# EasyEDA Pro project magic_board.epro, board main
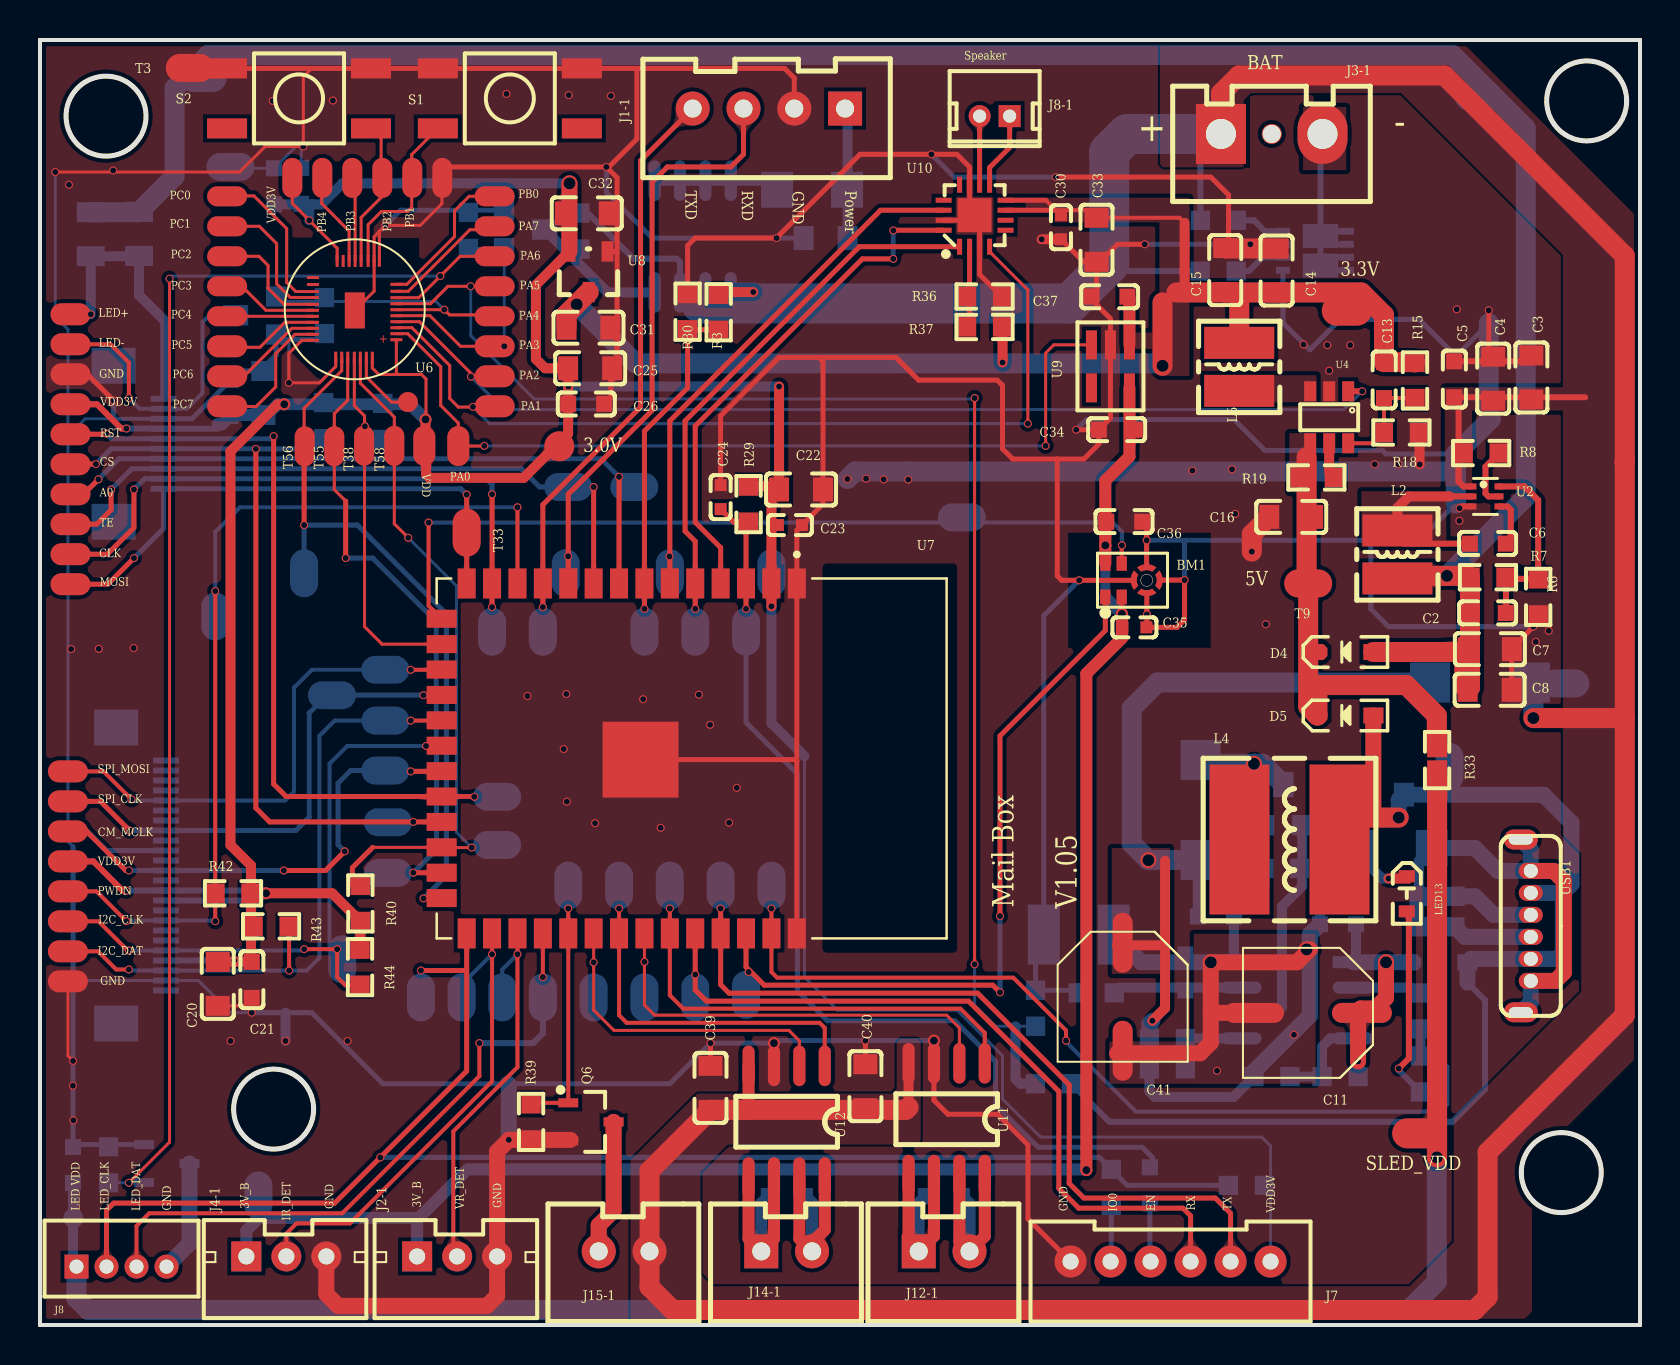
[diagram p0: board, top side]
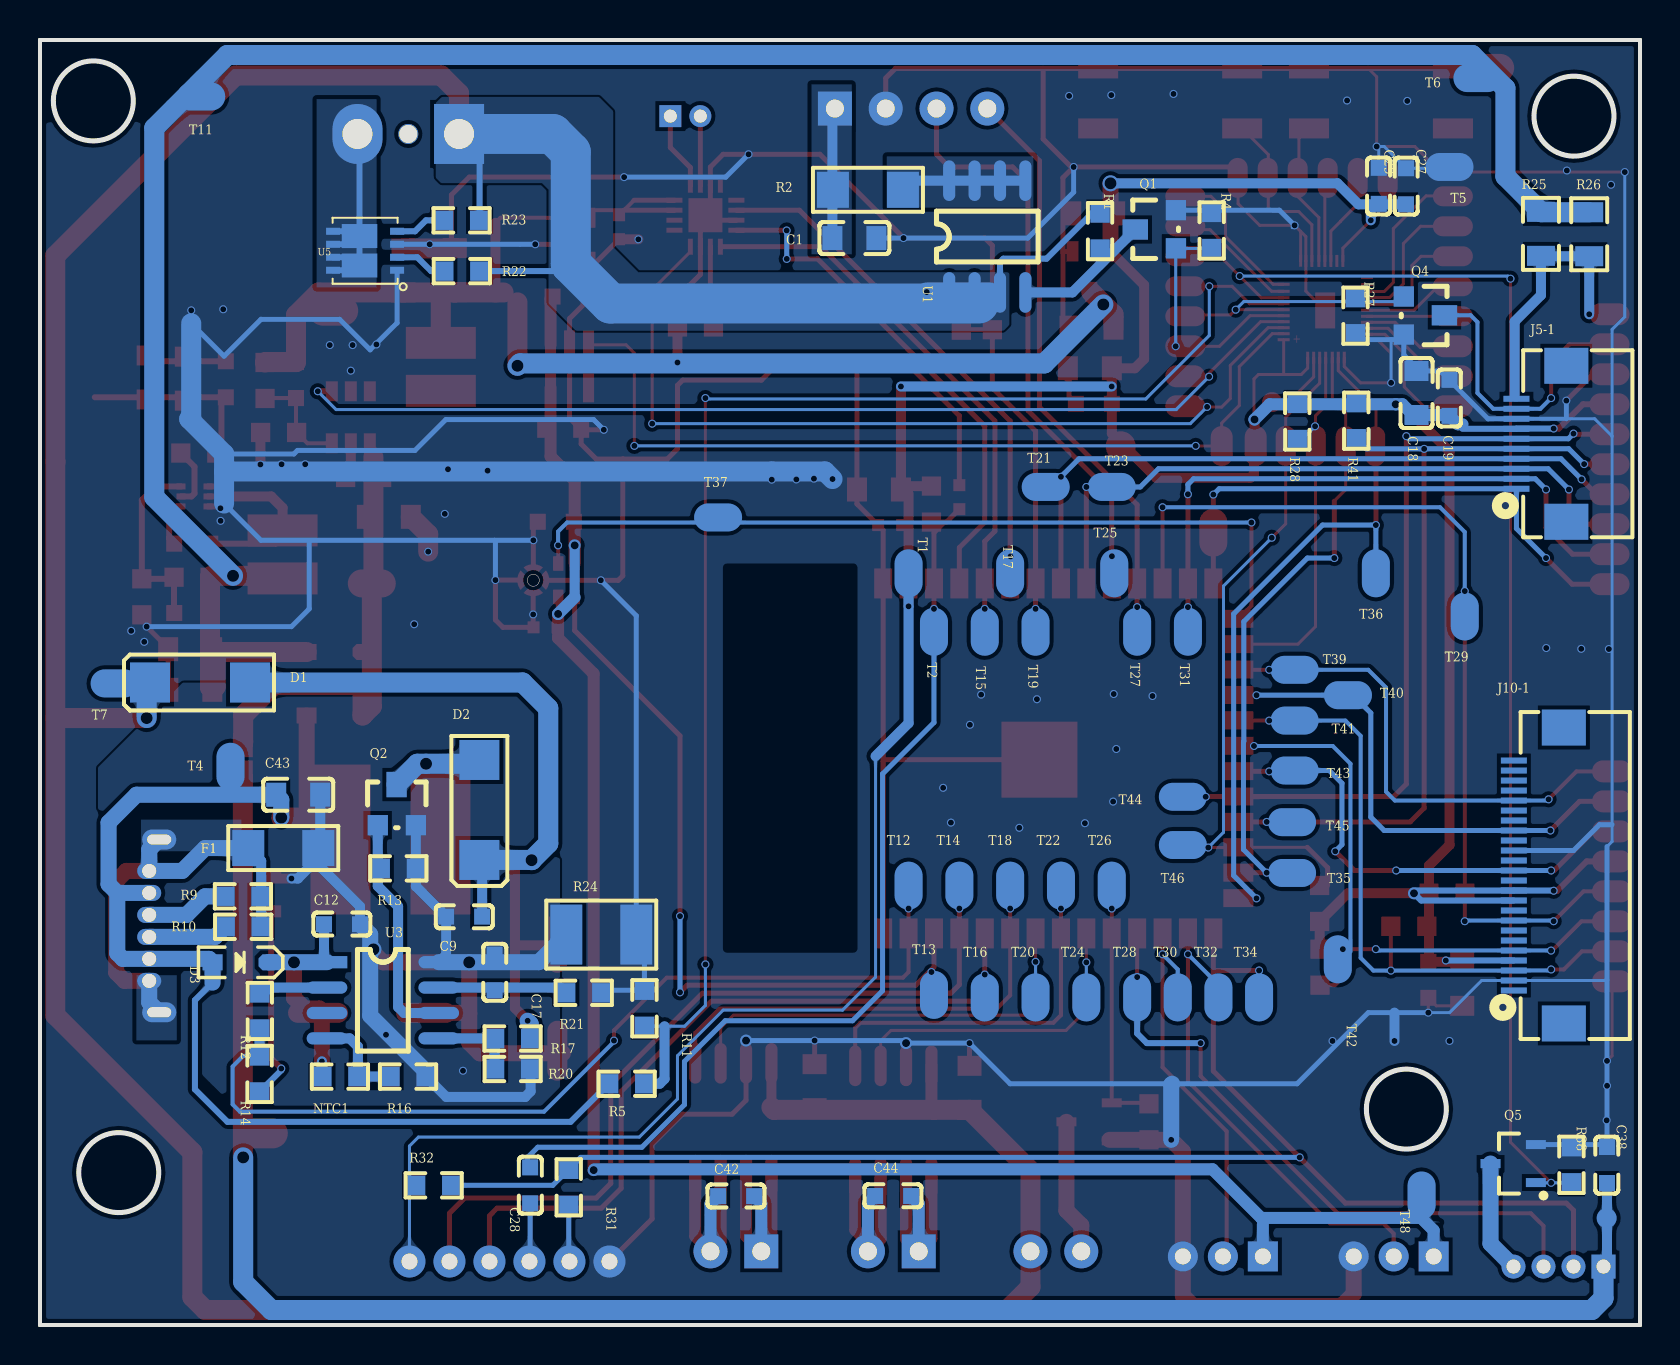
[diagram p1: board, bottom side, seen from below]

Outline 80.01 x 64.26 mm; copper layers: Top Layer, TOP SMD, BOT SMD, Mid-Layer 1, Inner1, Bottom Layer. Coordinates in mm from the lower left corner of the outline.
Outline path: circle c55.34,37.24 r0.3 ; 5.29,60.69 arc(1.32,60.17) 5.27,60.78 ; 13.67,11.03 arc(9.7,10.51) 13.66,11.12 ; 78.06,7.85 arc(74.09,7.34) 78.05,7.95 ; 79.33,61.45 arc(75.36,60.93) 79.32,61.54 ; 0,64.26 0,0 80.01,0 80.01,64.26 0,64.26
Stack: Top Layer 0.0356mm / Dielectric 1 0.254mm FR-4 er 4.2 / TOP SMD 0.036mm / Dielectric 4 0.127mm er 4.2 / BOT SMD 0.036mm / Dielectric 3 0.254mm er 4.2 / Mid-Layer 1 0.0356mm / Dielectric2 0.127mm FR-4 er 4.2 / Dielectric1 0.274mm PP er 4.5 / Bottom Layer 0.0356mm

## Design rules (mm)
spacing Clearance (default): track to track 0.3, other pairs 0.3 to 0.3
track width Width (default): min 0.1, default 0.1, max 2
differential pair DiffPairsRouting (default): width min 0.381, default 0.381, max 0.381; gap min 0.254, default 0.254
via RoutingVias (default): diameter min 0.4, default 0.8, max 1; hole min 0.3, default 0.6, max 0.8

## Placement (name value [footprint] x y rotation side)
BM1  SD18OB261-104  [DIG-MIC]  54.46 37.13 90 top
C1  22uF  [C0805]  39.29 54.36 0 bottom
C2  24PF  [C0603]  72.4 35.6 0 top
C3  10UF  [C0805]  74.58 47.38 90 top
C4  10UF  [C0805]  72.67 47.32 90 top
C5  0.1UF  [C0603]  70.72 47.29 270 top
C6  0.1uF  [C0603]  72.4 39.07 0 top
C7  22UF  [C0805]  72.5 33.8 0 top
C8  22UF  [C0805]  72.49 31.77 0 top
C9  0.1uF  [C0603]  58.8 20.42 0 bottom
C11  220UF  [CAP E_SMD_6.5*6.5]  63.25 15.62 180 top
C12  0.1uF  [C0603]  64.91 20.04 180 bottom
C13  33PF  [C0603]  67.21 47.25 270 top
C14  22UF  [C0805]  61.84 52.73 90 top
C15  22UF  [C0805]  59.27 52.75 90 top
C16  22UF  [C0805]  62.57 40.41 0 top
C17  0.1uF  [C0603]  57.28 17.63 270 bottom
C18  22uF  [C0805]  11.18 46.61 270 bottom
C19  0.1uF  [C0603]  9.52 46.37 90 bottom
C20  10UF  [C0805]  8.89 17.06 270 top
C21  0.1UF  [C0603]  10.59 17.26 270 top
C22  22uF  [C0805]  38.06 41.78 0 top
C23  0.1UF  [C0402]  37.5 40 0 top
C24  105  [C0402]  34.04 41.4 270 top
C25  10uF  [C0805]  27.51 47.85 180 top
C26  0.1uF  [C0603]  27.31 46.07 180 top
C27  NC  [C0603]  11.7 56.94 270 bottom
C28  0R  [C0603]  55.5 6.98 270 bottom
C29  0.1uF  [C0603]  13.06 56.97 90 bottom
C30  0.1UF  [C0402]  51.05 54.9 270 top
C31  22UF  [C0805]  27.43 49.87 0 top
C32  22UF  [C0805]  27.34 55.59 0 top
C33  22uF  [C0805]  52.83 54.27 270 top
C34  105  [C0603]  53.85 44.77 0 top
C35  0.1UF  [C0402]  54.73 34.89 0 top
C36  200PF  [C0603]  54.22 40.17 0 top
C37  105  [C0603]  53.48 51.43 180 top
C38  0.1uF  [C0603]  1.65 8 90 bottom
C39  22uF  [C0805]  33.53 11.86 90 top
C40  22uF  [C0805]  41.27 11.94 90 top
C41  100UF/25V  [CAP E_SMD_6.5*6.5]  54.13 16.26 270 top
C42  0.1UF  [C0603]  45.2 6.44 180 bottom
C43  22uF  [C0805]  67.1 26.52 180 bottom
C44  0.1UF  [C0603]  37.35 6.45 180 bottom
D1  SS34  [DIODE SMA DO214AC]  72.01 32.13 0 bottom
D2  SS34  [DIODE SMA DO214AC]  58.04 25.76 270 bottom
D3  1N4148  [SOD-323]  69.98 18.14 180 bottom
D4  IN5817  [SOD-323]  65.28 33.65 180 top
D5  IN5817  [SOD-323]  65.28 30.48 180 top
F1  1.5A  [R1206]  67.85 23.85 180 bottom
J1-1  2.54MM/Male  [XH2.54-LI-4P]  36.45 60.83 0 top
J2-1  2.54MM  [PH2.0-LI-3P]  20.86 3.43 0 top
J3-1  2.54MM  [XH2.54-LI-3P]  61.59 59.56 0 top
J4-1  2.0MM/Female  [PH2.0-LI-3P]  12.32 3.43 0 top
J5-1  FPC Connector  [FPC0.5 2H-WS-10P]  3.68 44.07 90 bottom
J7  2.54MM  [J CON6P 2.0]  61.54 3.17 180 top
J8  CON 4P  [J CON4P1.5]  4.08 2.92 0 top
J8-1  2.0MM/Male  [ZH1.5-LI-2p]  47.74 60.45 180 top
J10-1  HDR-1X16  [FPC0.5 2H-WS-24P]  3.81 22.48 90 bottom
J12-1  2.54MM  [XH2.54-LI-2P]  45.21 3.68 0 top
J14-1  2.54MM  [XH2.54-LI-2P]  37.34 3.68 0 top
J15-1  2.54MM  [XH2.54-LI-2P#2]  29.21 3.68 0 top
L2  4.7UH/1A  [CD32]  67.88 38.53 270 top
L4  15uH  [CD75]  62.48 24.28 180 top
L5  1UH/1A  [CD32]  59.97 47.91 270 top
LED13  LED  [LED 0603]  68.35 21.56 90 top
NOREF  -  [Pad_ie63]  1.4 26.19 270 top
NOREF#2  -  [Pad_ie34]  9.36 56.44 270 top
NOREF#3  -  [Pad_ie21]  69.87 28.89 90 top
NOREF#4  -  [Pad_ie24]  12.62 57.36 180 top
NOREF#5  -  [Pad_ie60]  1.4 20.19 270 top
NOREF#6  -  [Pad_ie39]  20.12 57.36 0 top
NOREF#7  -  [Pad_ie58]  1.4 18.69 270 top
NOREF#8  -  [Pad_ie43]  22.74 47.44 270 top
NOREF#9  -  [Pad_ie40]  22.74 53.44 270 top
NOREF#10  -  [Pad_ie50]  1.52 43.05 270 top
NOREF#11  -  [Pad_ie42]  22.74 51.94 270 top
NOREF#12  -  [Pad_ie44]  22.74 45.94 270 top
NOREF#13  -  [Pad_ie20]  69.87 27.73 90 top
NOREF#14  -  [Pad_ie27]  9.36 45.94 270 top
NOREF#15  -  [Pad_ie57]  1.4 24.69 90 top
NOREF#16  -  [Pad_ie31]  9.36 53.44 270 top
NOREF#17  -  [Pad_ie64]  1.4 27.69 270 top
NOREF#18  -  [Pad_ie46]  19.22 43.96 0 top
NOREF#19  -  [Pad_ie65]  1.67 5.34 90 top
NOREF#20  -  [Pad_ie59]  1.4 21.69 270 top
NOREF#21  -  [Pad_ie54]  1.52 37.05 270 top
NOREF#22  -  [Pad_ie38]  22.74 48.94 270 top
NOREF#23  -  [Pad_ie51]  1.52 46.05 270 top
NOREF#24  -  [Pad_ie49]  1.52 47.55 270 top
NOREF#25  -  [Pad_ie33]  9.36 54.94 270 top
NOREF#26  -  [Pad_ie61]  1.4 23.19 270 top
NOREF#27  -  [Pad_ie45]  20.92 43.95 0 top
NOREF#28  -  [Pad_ie22]  15.62 57.36 180 top
NOREF#29  -  [Pad_ie55]  1.52 38.55 270 top
NOREF#30  -  [Pad_ie28]  9.36 47.44 270 top
NOREF#31  -  [Pad_ie25]  17.12 57.36 180 top
NOREF#32  -  [Pad_ie52]  1.52 40.05 270 top
NOREF#33  -  [Pad_ie19]  68.87 9.58 90 top
NOREF#34  -  [Pad_ie30]  9.36 50.44 270 top
NOREF#35  -  [Pad_ie17]  25.97 43.94 90 top
NOREF#36  -  [Pad_ie41]  22.74 50.44 270 top
NOREF#37  -  [Pad_ie36]  22.74 56.44 270 top
NOREF#38  -  [Pad_ie35]  18.4 46.15 270 top
NOREF#39  -  [Pad_ie23]  14.12 57.36 180 top
NOREF#40  -  [Pad_ie32]  9.36 48.94 270 top
NOREF#41  -  [Pad_ie18]  65.35 50.72 90 top
NOREF#42  -  [Pad_ie37]  22.74 54.94 270 top
NOREF#43  -  [Pad_ie48]  1.52 49.05 270 top
NOREF#44  -  [Pad_ie56]  1.52 44.55 90 top
NOREF#45  -  [Pad_ie62]  1.4 17.19 270 top
NOREF#46  -  [Pad_ie47]  1.52 50.55 270 top
NOREF#47  -  [Pad_ie53]  1.52 41.55 270 top
NOREF#48  -  [Pad_ie26]  18.62 57.36 180 top
NOREF#49  -  [Pad_ie29]  9.36 51.94 270 top
NTC1  NTC-TNF103F3950FBT  [R0603]  65.01 12.42 0 bottom
Q1  BX3400  [SOT-23]  23.19 53.72 90 bottom
Q2  BX3400  [SOT-23]  63.24 24.98 180 bottom
Q4  BX3400  [SOT-23]  11.83 51.56 270 bottom
Q5  BX3400  [SOT23-3L]  6.35 8.07 90 bottom
Q6  BX3400  [SOT23-3L]  27.56 10.16 270 top
R1  10K  [R0603]  27 54.71 90 bottom
R2  0R/1206  [R1206]  38.61 56.77 180 bottom
R3  1M  [R0603]  33.94 50.64 270 top
R4  10K  [R0603]  21.42 54.74 90 bottom
R5  330K  [R0603]  50.67 12.06 0 bottom
R6  15K  [R0603]  74.92 36.41 90 top
R7  110K  [R0603]  72.41 37.39 180 top
R8  10K  [R0603]  72.07 43.6 0 top
R9  5.1K  [R0603]  69.86 21.44 180 bottom
R10  5.1K  [R0603]  69.85 19.91 180 bottom
R11  100K  [R0603]  49.78 15.84 270 bottom
R12  300R  [R0603]  69.02 15.7 270 bottom
R13  10K  [R0603]  62.09 22.84 180 bottom
R14  150R  [R0603]  69.03 12.55 90 bottom
R15  45K  [R0603]  68.76 47.23 90 top
R16  2K  [R0603]  61.61 12.42 180 bottom
R17  82K 1%  [R0603]  56.38 14.33 0 bottom
R18  10K  [R0603]  68.08 44.63 180 top
R19  100K  [R0603]  63.83 42.38 0 top
R20  15K 1%  [R0603]  56.38 12.8 180 bottom
R21  47K  [R0603]  52.82 16.61 180 bottom
R22  10R  [R0603]  58.92 52.7 0 bottom
R23  10R  [R0603]  58.93 55.24 0 bottom
R24  0.1R/0.5W  [R 1210_L]  51.94 19.53 180 bottom
R25  NC  [R0805]  4.95 54.57 270 bottom
R26  15R  [R0805]  2.54 54.55 270 bottom
R27  10K  [R0603]  14.23 50.47 90 bottom
R28  10K  [R0603]  17.14 45.18 90 bottom
R29  10K  [R0603]  35.43 41.05 270 top
R30  390K  [R0603]  32.39 50.67 90 top
R31  0R  [R0603]  53.57 6.88 270 bottom
R32  10K  [R0603]  60.33 6.98 180 bottom
R33  0R  [R0603]  69.86 28.25 270 top
R36  100K  [R0603]  47.23 51.43 0 top
R37  100K  [R0603]  47.23 49.91 0 top
R38  10K  [R0603]  3.43 8.01 90 bottom
R39  10K  [R0603]  24.56 10.16 270 top
R40  10K  [R0603]  16.02 21.08 90 top
R41  10K  [R0603]  14.19 45.22 270 bottom
R42  10K  [R0603]  9.65 21.59 180 top
R43  2.2K  [R0603]  11.56 19.94 180 top
R44  2.2K  [R0603]  16 17.9 270 top
S1  Tact Switch  [KEY Tact Switch 4.5x4.5 -S]  23.49 61.34 180 top
S2  Tact Switch  [KEY Tact Switch 4.5x4.5 -S#2]  12.95 61.34 180 top
T1  Test Point  [J CON1]  36.58 37.59 0 bottom
T2  Test Point  [J CON1]  35.31 34.67 180 bottom
T3  Test Point  [J CON1]  7.49 62.86 270 top
T4  Test Point  [J CON1]  70.48 27.92 0 bottom
T5  Test Point  [J CON1]  9.52 57.91 270 bottom
T6  Test Point  [J CON1]  8.13 62.36 270 bottom
T7  Test Point  [J CON1]  76.28 32.08 270 bottom
T9  -  [J CON1]  63.42 37.08 270 top
T11  Test Point  [J CON1]  71.95 61.43 270 bottom
T12  Test Point  [J CON1]  36.58 21.97 180 bottom
T13  Test Point  [J CON1]  35.31 16.51 0 bottom
T14  Test Point  [J CON1]  34.04 21.97 0 bottom
T15  Test Point  [J CON1]  32.77 34.67 180 bottom
T16  Test Point  [J CON1]  32.77 16.38 0 bottom
T17  Test Point  [J CON1]  31.5 37.59 180 bottom
T18  Test Point  [J CON1]  31.5 21.97 180 bottom
T19  Test Point  [J CON1]  30.23 34.67 0 bottom
T20  Test Point  [J CON1]  30.23 16.38 0 bottom
T21  Test Point  [J CON1]  29.72 41.91 90 bottom
T22  Test Point  [J CON1]  28.96 21.97 0 bottom
T23  Test Point  [J CON1]  26.42 41.91 270 bottom
T24  Test Point  [J CON1]  27.69 16.38 180 bottom
T25  Test Point  [J CON1]  26.29 37.59 0 bottom
T26  Test Point  [J CON1]  26.42 21.97 180 bottom
T27  Test Point  [J CON1]  25.15 34.67 180 bottom
T28  Test Point  [J CON1]  25.15 16.38 180 bottom
T29  Test Point  [J CON1]  8.76 35.43 180 bottom
T30  Test Point  [J CON1]  23.11 16.38 180 bottom
T31  Test Point  [J CON1]  22.61 34.67 0 bottom
T32  Test Point  [J CON1]  21.08 16.38 180 bottom
T33  Test Point  [J CON1]  21.34 39.62 180 top
T34  Test Point  [J CON1]  19.05 16.38 180 bottom
T35  Test Point  [J CON1]  17.4 22.61 90 bottom
T36  Test Point  [J CON1]  13.21 37.59 180 bottom
T37  Test Point  [J CON1]  46.1 40.39 270 bottom
T38  Test Point  [J CON1#2]  16.18 43.97 180 top
T39  Test Point  [J CON1]  17.27 32.77 90 bottom
T40  Test Point  [J CON1]  14.61 31.5 90 bottom
T41  Test Point  [J CON1]  17.27 30.23 90 bottom
T42  Test Point  [J CON1]  15.11 18.29 180 bottom
T43  Test Point  [J CON1]  17.27 27.73 90 bottom
T44  Test Point  [J CON1]  22.86 26.42 90 bottom
T45  Test Point  [J CON1]  17.4 25.15 90 bottom
T46  Test Point  [J CON1]  22.86 24 90 bottom
T48  Test Point  [J CON1]  10.92 6.48 180 bottom
T55  Test Point  [J CON1#3]  14.76 43.94 180 top
T56  Test Point  [J CON1#2]  13.21 43.94 180 top
T58  Test Point  [J CON1#2]  17.69 43.96 180 top
U1  XR4407A  [SOP8]  32.64 54.43 90 bottom
U2  BXG6968  [SOT563-6]  72.28 41.43 270 top
U3  PMS132B  [SO-8]  65.66 18.14 180 bottom
U4  BXO60010  [SOT-23-6]  64.47 45.39 180 top
U5  AP0803QD  [DFN3333-A]  63.75 53.72 0 bottom
U6  GPBA02B-C  [GPBA02B-DICE]  15.73 50.8 180 top
U7  ESP32-S3-WROOM-1  [XCVR_ESP32-S3-WROOM-1-N4]  32.59 28.33 270 top
U8  LDO 3.0V  [SOT23]  27.43 52.67 180 top
U9  BL8653/LN1134A-30  [SOT-23-5]  54.8 48.37 180 top
U10  HT517  [QFN16]  46.74 55.5 90 top
U11  AM2837  [SOP8]  45.34 10.29 270 top
U12  AM2837  [SOP8]  37.34 10.17 270 top
USB1  USB_C 6Pin  [USB Type-C Pitch1.1]  74.55 19.96 90 top

## Footprints (pads in the part's own frame, mm; a bottom-side part is the same pattern mirrored in y, then rotated)
C0402
  rect 0.6x0.6 smd: 1(-0.6,0) 2(0.6,0)
C0603
  rect 0.8x0.8 smd: 1(-0.9,0) 2(0.9,0)
C0805
  rect 1x1.2 smd: 1(-1.1,0) 2(1.1,0)
CAP E_SMD_6.5*6.5
  oval 3x1 smd: 1(-2.86,0.012) 2(2.541,0.012)
CD32
  rect 1.6x3.5 smd: 1(-1.2,0) 2(1.2,0)
CD75
  rect 3x7.5 smd: 1(-2.5,0) 2(2.5,0)
DFN3333-A
  rect 0.7x0.35 smd: 1(-1.6,0.975) 2(-1.6,0.325) 3(-1.6,-0.325) 4(-1.6,-0.975) 5(1.6,-0.975) 6(1.6,-0.325) 7(1.6,0.325) 8(1.6,0.975)
  rect 1.778x1.2 smd: 5(0.28,-0.737) 7(0.28,0.737)
DIG-MIC
  rect 0.73x0.52 smd: 1(-0.714,1.187) 2(-0.714,0.366) 3(0.957,0.366) 4(0.957,1.187)
  round 0.076 smd: 5(-0.508,-0.889) 5(0.117,-0.255) 5(0.127,-1.514) 5(0.751,-0.879)
DIODE SMA DO214AC
  rect 2x2 smd: 1(-2.5,0) 2(2.5,0)
FPC0.5 2H-WS-10P
  rect 1.8x2.2 smd: 0(-3.9,0) 0(3.9,0)
  rect 0.3x1.3 smd: 1(2.25,2.497) 2(1.75,2.497) 3(1.25,2.497) 4(0.75,2.497) 5(0.25,2.497) 6(-0.25,2.497) 7(-0.75,2.497) 8(-1.25,2.497) 9(-1.75,2.497) 10(-2.25,2.497)
FPC0.5 2H-WS-24P
  rect 1.8x2.2 smd: 0(-7.4,0) 0(7.4,0)
  rect 0.3x1.3 smd: 1(-5.75,2.497) 2(-5.25,2.497) 3(-4.75,2.497) 4(-4.25,2.497) 5(-3.75,2.497) 6(-3.25,2.497) 7(-2.75,2.497) 8(-2.25,2.497) 9(-1.75,2.497) 10(-1.25,2.497) 11(-0.75,2.497) 12(-0.25,2.497) 13(0.25,2.497) 14(0.75,2.497) 15(1.25,2.497) 16(1.75,2.497) 17(2.25,2.497) 18(2.75,2.497) 19(3.25,2.497) 20(3.75,2.497) 21(4.25,2.497) 22(4.75,2.497) 23(5.25,2.497) 24(5.75,2.497)
GPBA02B-DICE
  rect 0.6x0.15 smd: 1(-2.086,1.525) 2(-2.086,1.225) 3(-2.086,0.925) 4(-2.086,0.625) 5(-2.086,0.325) 6(-2.086,0.025) 7(-2.086,-0.275) 8(-2.086,-0.575) 9(-2.086,-0.895) 10(-2.086,-1.245) 18(2.086,-1.585) 19(2.086,-1.235) 20(2.086,-0.885) 21(2.086,-0.585) 22(2.086,-0.245) 23(2.086,0.055) 24(2.086,0.355) 25(2.086,0.655) 26(2.086,0.955) 27(2.086,1.255) 28(2.086,1.555)
  rect 0.15x0.6 smd: 11(-1.236,-2.425) 11(-0.974,-2.415) 12(-0.674,-2.415) 13(-0.324,-2.415) 14(-0.024,-2.415) 15(0.276,-2.415) 16(0.576,-2.415) 17(0.876,-2.415) 29(0.946,2.425) 30(0.646,2.425) 31(0.346,2.425) 32(0.016,2.425) 33(-0.284,2.425) 34(-0.584,2.425) 35(-0.884,2.425)
  rect 1x1.8 smd: 36(-0.009,0.06)
J CON1
  oval 1.4x2.4 smd: 1(0,0)
J CON1#2
  oval 1x2 smd: 1(-0.03,0)
J CON1#3
  oval 1x2 smd: 1(0.04,0)
J CON4P1.5
  rect 1.2x1.2 hole 0.7: 1(-2.25,0)
  round 1.2 hole 0.7: 2(-0.75,0) 3(0.75,0) 4(2.25,0)
J CON6P 2.0
  round 1.6 hole 0.8: 1(0,0) 2(2,0) 3(4,0) 4(6,0) 5(8,0) 6(10,0)
KEY Tact Switch 4.5x4.5 -S
  rect 2x1 smd: 1(3.6,1.5) 2(-3.6,-1.5) 2(3.6,-1.5) 3(-3.6,1.5)
KEY Tact Switch 4.5x4.5 -S#2
  rect 2x1 smd: 1(-3.6,1.5) 2(-3.6,-1.5) 2(3.6,-1.5) 3(3.6,1.5)
LED 0603
  rect 0.6x0.8 smd: 1(-0.88,0) 2(0.88,0)
Pad_ie17
  round 1.5 smd: 15(0,0)
Pad_ie18
  oval 1.5x2.5 smd: 13(0,0)
Pad_ie19
  oval 1.5x2.5 smd: 13(0,0)
Pad_ie20
  rect 1x1 smd: 12(0,0)
Pad_ie21
  rect 1x1 smd: 11(0,0)
Pad_ie22
  oval 1x2 smd: 10(0,0)
Pad_ie23
  oval 1x2 smd: 10(0,0)
Pad_ie24
  oval 1x2 smd: 10(0,0)
Pad_ie25
  oval 1x2 smd: 10(0,0)
Pad_ie26
  oval 1x2 smd: 10(0,0)
Pad_ie27
  oval 1.1x2 smd: 10(0,0)
Pad_ie28
  oval 1.1x2 smd: 10(0,0)
Pad_ie29
  oval 1x2 smd: 10(0,0)
Pad_ie30
  oval 1x2 smd: 10(0,0)
Pad_ie31
  oval 1x2 smd: 10(0,0)
Pad_ie32
  oval 1.1x2 smd: 10(0,0)
Pad_ie33
  oval 1x2 smd: 10(0,0)
Pad_ie34
  oval 1x2 smd: 10(0,0)
Pad_ie35
  round 1 smd: 10(0,0)
Pad_ie36
  oval 1x2 smd: 10(0,0)
Pad_ie37
  oval 1x2 smd: 10(0,0)
Pad_ie38
  oval 1.1x2 smd: 10(0,0)
Pad_ie39
  oval 1x2 smd: 10(0,0)
Pad_ie40
  oval 1x2 smd: 10(0,0)
Pad_ie41
  oval 1x2 smd: 10(0,0)
Pad_ie42
  oval 1x2 smd: 10(0,0)
Pad_ie43
  oval 1.1x2 smd: 10(0,0)
Pad_ie44
  oval 1.1x2 smd: 10(0,0)
Pad_ie45
  oval 1.1x2 smd: 10(0,0)
Pad_ie46
  oval 1.1x2 smd: 10(0,0)
Pad_ie47
  oval 1.1x2 smd: 8(0,0)
Pad_ie48
  oval 1.1x2 smd: 9(0,0)
Pad_ie49
  oval 1.1x2 smd: 10(0,0)
Pad_ie50
  oval 1.1x2 smd: 10(0,0)
Pad_ie51
  oval 1.1x2 smd: 9(0,0)
Pad_ie52
  oval 1.1x2 smd: 10(0,0)
Pad_ie53
  oval 1.1x2 smd: 9(0,0)
Pad_ie54
  oval 1.1x2 smd: 10(0,0)
Pad_ie55
  oval 1.1x2 smd: 9(0,0)
Pad_ie56
  oval 1.1x2 smd: 10(0,0)
Pad_ie57
  oval 1.1x2 smd: 10(0,0)
Pad_ie58
  oval 1.1x2 smd: 9(0,0)
Pad_ie59
  oval 1.1x2 smd: 9(0,0)
Pad_ie60
  oval 1.1x2 smd: 10(0,0)
Pad_ie61
  oval 1.1x2 smd: 10(0,0)
Pad_ie62
  oval 1.1x2 smd: 10(0,0)
Pad_ie63
  oval 1.1x2 smd: 9(0,0)
Pad_ie64
  oval 1.1x2 smd: 8(0,0)
Pad_ie65
  round 1 smd far side: 14(0,0)
PH2.0-LI-3P
  rect 1.5x1.5 hole 0.8: 1(-2,0)
  round 1.5 hole 0.8: 2(0,0) 3(2,0)
QFN16
  rect 1.7x1.7 smd: 0(0,0)
  rect 0.8x0.25 smd: 1(-1.575,0.75) 2(-1.575,0.25) 3(-1.575,-0.25) 4(-1.575,-0.75) 9(1.524,-0.75) 10(1.524,-0.25) 11(1.524,0.25) 12(1.524,0.75)
  rect 0.25x0.8 smd: 5(-0.75,-1.55) 6(-0.25,-1.55) 7(0.25,-1.55) 8(0.75,-1.55) 13(0.75,1.55) 14(0.25,1.55) 15(-0.25,1.55) 16(-0.75,1.55)
R0603
  rect 0.962x0.962 smd: 1(-0.9,0) 2(0.9,0)
R0805
  rect 1x1.4 smd: 1(-1.1,0) 2(1.1,0)
R1206
  rect 1.6x1.8 smd: 1(-1.75,0) 2(1.75,0)
R 1210_L
  rect 1.6x3 smd: 1(-1.75,-0.01) 2(1.75,-0.01)
SO-8
  rect 2.032x0.61 smd: 1(0,0)
  oval 2.032x0.61 smd: 2(0,-1.27) 3(0,-2.54) 4(0,-3.81) 5(5.588,-3.81) 6(5.588,-2.54) 7(5.588,-1.27) 8(5.588,0)
SOD-323
  rect 1x0.8 smd: 1(-1.4,0)
  custom 1x0.8 smd: 2(1.4,0)
SOP8
  oval 2.032x0.61 smd: 1(-2.794,1.905) 2(-2.794,0.635) 3(-2.794,-0.635) 4(-2.794,-1.905) 5(2.794,-1.905) 6(2.794,-0.635) 7(2.794,0.635) 8(2.794,1.905)
SOT23
  rect 0.6x1.016 smd: 1(-0.953,-1.016) 2(0.953,-1.016) 3(-0.013,1.016)
SOT23-3L
  rect 0.45x1 smd: 1(-0.95,-1.143) 2(0.95,-1.143) 3(0,1.125)
SOT563-6
  rect 0.3x0.45 smd: 1(-0.5,-0.675) 2(0,-0.675) 3(0.5,-0.675) 4(0.5,0.675) 5(0,0.675) 6(-0.5,0.675)
SOT-23
  rect 1.016x1.016 smd: 1(0.124,0.016) 2(2.029,0.016)
  rect 1.016x1.27 smd: 3(1.064,2.048)
SOT-23-5
  rect 0.55x1.45 smd: 1(0.324,-0.643) 2(1.274,-0.643) 3(2.224,-0.643) 4(2.224,1.507) 5(0.324,1.507)
SOT-23-6
  rect 0.6x1 smd: 1(-0.95,-1.3) 2(0,-1.3) 3(0.95,-1.3) 4(0.95,1.3) 5(0,1.3) 6(-0.95,1.3)
USB Type-C Pitch1.1
  oval 1x1.7 hole 0.5x1.2: 0(-4.32,0.5) 0(4.32,0.5)
  oval 0.8x1.2 hole 0.7: 1(-2.75,0) 2(-1.65,0) 3(-0.55,0) 4(0.55,0) 5(1.65,0) 6(2.75,0)
XCVR_ESP32-S3-WROOM-1-N4
  rect 1.5x0.9 smd: 1(-8.75,5.26) 2(-8.75,3.99) 3(-8.75,2.72) 4(-8.75,1.45) 5(-8.75,0.18) 6(-8.75,-1.09) 7(-8.75,-2.36) 8(-8.75,-3.63) 9(-8.75,-4.9) 10(-8.75,-6.17) 11(-8.75,-7.44) 12(-8.75,-8.71) 13(-8.75,-9.98) 14(-8.75,-11.25) 27(8.75,-11.25) 28(8.75,-9.98) 29(8.75,-8.71) 30(8.75,-7.44) 31(8.75,-6.17) 32(8.75,-4.9) 33(8.75,-3.63) 34(8.75,-2.36) 35(8.75,-1.09) 36(8.75,0.18) 37(8.75,1.45) 38(8.75,2.72) 39(8.75,3.99) 40(8.75,5.26)
  rect 0.9x1.5 smd: 15(-6.985,-12.5) 16(-5.715,-12.5) 17(-4.445,-12.5) 18(-3.175,-12.5) 19(-1.905,-12.5) 20(-0.635,-12.5) 21(0.635,-12.5) 22(1.905,-12.5) 23(3.175,-12.5) 24(4.445,-12.5) 25(5.715,-12.5) 26(6.985,-12.5)
  rect 3.8x3.8 smd: 41(0.06,-2.554)
XH2.54-LI-2P
  rect 1.7x1.7 hole 0.9: 1(-1.27,0)
  round 1.7 hole 0.9: 2(1.27,0)
XH2.54-LI-2P#2
  round 1.7 hole 0.9: 1(-1.27,0) 2(1.27,0)
XH2.54-LI-3P
  rect 2.5x3 hole 1.5: 1(-2.54,0)
  round 1 hole 0.9: 2(0,0)
  oval 2.5x3 hole 1.5: 3(2.54,0)
XH2.54-LI-4P
  round 1.7 hole 0.9: 1(-3.81,0) 2(-1.27,0) 3(1.27,0)
  rect 1.7x1.7 hole 0.9: 4(3.81,0)
ZH1.5-LI-2p
  rect 1.1x1.1 hole 0.65: 1(-0.75,0)
  round 1.1 hole 0.65: 2(0.75,0)

## Nets
VBAT_7.4V: C3.1 C4.1 C5.2 C39.1 C40.1 D1.2 J3-1.1 J15-1.2 R1.2 R3.1 R8.1 R22.1 R23.1 T7.1 U1.1 U1.2 U1.3 U2.1 U11.4 U12.4
VDD_3.0V: C18.2 C19.1 C20.1 C21.1 C22.1 C23.1 C25.2 C26.2 C27.2 C29.1 C32.1 J5-1.4 J7.1 J10-1.4 J10-1.10 J10-1.11 NOREF#4.10 NOREF#18.10 NOREF#23.9 NOREF#26.10 NOREF#35.15 R28.2 R29.1 R32.1 R40.1 R41.1 R42.1 R43.2 R44.1 T1.1 U6.1 U6.17 U6.35 U7.2 U8.2
VDD_3.0V_B: BM1.2 BM1.4 C34.2 C35.1 C36.1 J2-1.1 J4-1.1 T48.1 U9.5
VDD_3.3V: C13.1 C14.1 C15.1 C30.1 C31.1 C33.1 C37.1 L5.1 NOREF#41.13 R15.2 R37.2 U8.3 U9.1 U10.7 U10.8
VDD_5.0V: C2.1 C7.1 C8.1 D4.1 L2.2 R7.2 R25.1 R26.1 T6.1 T11.1
VDD_LED_5.0V: C16.2 D4.2 D5.2 NOREF#3.11 R19.1 R33.1 T9.1 U4.4
VSS: C9.2 C11.2 C12.2 C17.1 C41.2 C43.2 F1.2 LED13.2 Q2.2 R13.2 R16.2 R20.2 R24.1 U3.8
CHG_DET: R12.2 R14.2 T12.1 U7.39
CM_I2C_CLK: J10-1.5 NOREF#5.10 R44.2 T42.1 U7.20
CM_I2C_DATA: J10-1.3 NOREF#7.9 R43.1 T41.1 U7.19
CM_MCLK: J10-1.13 NOREF#15.10 T43.1 U7.21
CM_PWDN: J10-1.8 NOREF#20.9 R42.2 T29.1 U7.12
CM_SPI_CLK: J10-1.17 NOREF.9 T40.1 U7.18
CM_SPI_MOSI: J10-1.20 NOREF#17.8 T39.1 U7.17
CT_MT_CTR: Q6.1 R39.1 T26.1 U7.31
D_GND: BM1.5 C1.1 C3.2 C4.2 C5.1 C7.2 C8.2 C14.2 C15.2 C16.1 C18.1 C19.2 C20.2 C21.2 C22.2 C23.2 C24.1 C25.1 C26.1 C27.1 C29.2 C30.2 C31.2 C32.2 C33.2 C34.1 C35.2 C36.2 C37.2 C38.2 C39.2 C40.2 J1-1.3 J2-1.3 J4-1.3 J5-1.3 J7.6 J10-1.2 J10-1.15 NOREF#6.10 NOREF#24.10 NOREF#45.10 Q1.2 Q4.2 Q5.2 Q6.2 R4.2 R6.1 R11.1 R18.1 R21.2 R24.2 R27.1 R30.2 R36.2 R38.2 R39.2 S1.2 S2.2 T3.1 T5.1 U2.3 U4.2 U5.1 U5.3 U6.11 U6.28 U6.29 U7.1 U7.40 U7.41 U8.1 U9.2 U10.0 U10.3 U10.11 U10.15 U11.3 U12.3
DEVICE: NOREF#38.10 U6.34
EN: C24.2 C28.1 R29.2 T2.1 U7.3
EXD_LED_EN: NOREF#9.10 Q5.1 R38.1 U6.8
EXP_BST_EN: NOREF#8.10 U4.1 U6.4
EXP_DOOR_DET: NOREF#31.10 S2.1 U6.13
EXP_KET_DET: NOREF#48.10 S1.1 U6.12
EXP_LCDLED_EN: NOREF#36.10 Q4.1 R27.2 U6.6
EXP_MIC_EN: NOREF#27.10 U6.2 U9.3
EXP_PRT_EN: NOREF#22.10 Q1.1 R4.1 U6.5
EXP_SPI_CLK: T35.1 T55.1 U6.31 U7.25
EXP_SPI_CS: R40.2 T46.1 T58.1 U6.33 U7.24
EXP_SPI_MISO: R28.1 T38.1 U6.32 U7.16
EXP_SPI_MOSI: T36.1 T56.1 U6.30 U7.26
EXP_SPK_EN: NOREF#12.10 U6.3 U10.4
EXP_VUSB_DET: NOREF#11.10 R5.1 R11.2 U6.7
FE_MT_BK: T24.1 U7.32 U12.2
FE_MT_FW: T22.1 U7.33 U12.1
FL_MT_BK: T20.1 U7.34 U11.2
FL_MT_FW: T18.1 U7.35 U11.1
FLAG_VR_DET: J2-1.2 T30.1 U7.29
IR_FIN_DET: J4-1.2 T32.1 U7.28
L_GND: J8.4 Q5.3
LCD_A0: J5-1.7 NOREF#47.9 T21.1 U7.8
LCD_CS: J5-1.6 NOREF#10.10 R41.2 T45.1 U7.23
LCD_RST: J5-1.5 NOREF#44.10 T44.1 U7.22
LCD_SPI_CLK: J5-1.9 NOREF#29.9 T31.1 U7.13
LCD_SPI_MOSI: J5-1.10 NOREF#21.10 T33.1 U7.14
LCD_TE: J5-1.8 NOREF#32.10 T23.1 U7.9
LED_CLK: J8.2 R31.1 R32.2 T34.1 U7.27
LED_DATA: J8.3 T28.1 U7.30
MIC CLK: BM1.3 T37.1 U7.15
MIC_DATA: BM1.1 T13.1 U7.38
NETC2_2: C2.2 R6.2 R7.1 U2.6
NETC6_1: C6.1 L2.1 U2.2
NETC6_2: C6.2 U2.4
NETC9_1: C9.1 C41.1 D1.1 D2.2 R17.1
NETC11_1: C11.1 C12.1 D3.2 NTC1.2 U3.1
NETC13_2: C13.2 R15.1 R18.2 U4.6
NETC17_2: C17.2 R21.1 U3.7
NETC28_2: C28.2 J7.4
NETC42_1: C42.1 J12-1.2 U11.7 U11.8
NETC42_2: C42.2 J12-1.1 U11.5 U11.6
NETC44_1: C44.1 J14-1.2 U12.7 U12.8
NETC44_2: C44.2 J14-1.1 U12.5 U12.6
NETD2_1: D2.1 L4.2 Q2.3
NETF1_1: F1.1 R9.2 R10.2 USB1.0 USB1.1 USB1.6
NETJ3-1_3: J3-1.3 U5.5 U5.6 U5.7 U5.8
NETJ5-1_1: J5-1.1 NOREF#46.8 R25.2 R26.2
NETJ5-1_2: J5-1.2 NOREF#43.9 Q4.3
NETJ7_5: J7.5 R31.2
NETJ8-1_1: J8-1.1 U10.9
NETJ8-1_2: J8-1.2 U10.10
NETJ15-1_1: J15-1.1 Q6.3
NETL5_2: L5.2 U4.3
NETLED13_1: LED13.1 R14.1
NETQ1_3: Q1.3 R1.1 U1.4
NETQ2_1: Q2.1 R13.1 U3.6
NETR2_2: R2.2 U1.5 U1.6 U1.7 U1.8
NETR8_2: R8.2 U2.5
NETR9_1: R9.1 USB1.4
NETR10_1: R10.1 USB1.3
NETR12_1: R12.1 U3.2
NETR17_2: R17.2 R20.1 U3.5
NETR19_2: R19.2 U4.5
NETR22_2: R22.2 U5.2
NETR23_2: R23.2 U5.4
NETR36_1: R36.1 R37.1 U10.2
PA7: NOREF#42.10 U6.9
PB0: NOREF#37.10 U6.10
PB3: NOREF#28.10 U6.14
PB4: NOREF#39.10 U6.15
PB5: U6.16
PB6: U6.18
PB7: U6.19
PC0: NOREF#2.10 U6.20
PC1: NOREF#25.10 U6.21
PC2: NOREF#16.10 U6.22
PC3: NOREF#49.10 U6.23
PC4: NOREF#34.10 U6.24
PC5: NOREF#40.10 U6.25
PC6: NOREF#30.10 U6.26
PC7: NOREF#14.10 U6.27
PRT_POWER: C1.2 J1-1.4 R2.1
PRT_PW_DET: R3.2 R30.1 T19.1 U7.7
PRT_RXD: J1-1.2 T25.1 U7.10
PRT_TXD: J1-1.1 T27.1 U7.11
RXD0: J7.3 T16.1 U7.36
SLED_VDD: C38.1 J8.1 NOREF#13.12 NOREF#19.14 NOREF#33.13 R33.2
SPK_CLK: U7.4 U10.16
SPK_DATA: T15.1 U7.5 U10.1
SPK_FS: T17.1 U7.6 U10.14
T3: NTC1.1 R16.1 U3.4
TXD0: J7.2 T14.1 U7.37
VUSB_5.0V: C43.1 D3.1 D5.1 L4.1 R5.2 T4.1 USB1.2 USB1.5

Pads without a net: J3-1 2; J5-1 0; J10-1 0 1 6 7 9 12 14 16 18 19 21 22 23 24; S1 3; S2 3; U3 3; U6 36; U9 4; U10 5 6 12 13

## Via types
v1: diameter 0.6, hole 0.4, Top Layer to Bottom Layer, 8 vias
v2: diameter 0.4, hole 0.3, Top Layer to Bottom Layer, 171 vias
v3: diameter 0.8, hole 0.6, Top Layer to Bottom Layer, 12 vias

## Routing (per net, layer and track width the routed paths; a pad name or vN(x,y) marks a point on that pad's centre or on a via; arc(x,y) is an arc through that point)
VBAT_7.4V: length 222
  Top Layer w0.025: 79.25,43.18 79.75,43.18 79.25,43.18
  Top Layer w0.3: 77.27,46.39 C5.2 70.94,46.17 70.94,42.17 71.18,41.93 U2.1
  Top Layer w0.5: R3.1 34.05,51.66 v2(35.67,51.66) ; 43.43,10.89 U11.4 ; 35.31,10.76 35.43,10.89
  Top Layer w0.6: 35.43,10.89 U12.4
  Top Layer w1: 79.25,30.35 79.25,15.49 72.39,8.64 72.39,1.4 71.74,0.75 31.64,0.75 30.48,1.91 J15-1.2 30.48,7.71 C39.1 43.31,10.76 43.43,10.89 ; 79.25,30.35 79.25,43.18 ; 79.25,30.35 v3(74.68,30.35) ; 79.25,43.18 79.25,53.47 70.23,62.48 59.94,62.48 59.05,61.59 J3-1.1 ; 79.25,43.18 79.23,43.16
  Bottom Layer w0.3: U1.3 32,53.16 31.84,53.32 29.67,53.32 27.39,55.61 R1.2 ; 58.02,52.7 53.59,52.7 53.47,52.83 ; R23.1 58.03,59.42 58.17,59.56
  Bottom Layer w1: 32.51,51.64 U1.2 U1.1 35.67,51.64 ; 53.47,52.83 53.47,53.07 ; D1.2 74.68,31.96 v3(74.68,30.35)
  Bottom Layer w2: J3-1.1 54.37,59.56 53.47,58.65 53.47,53.07 51.48,51.08 33.07,51.08
VDD_3.0V: length 208.3
  Top Layer w0.15: v3(26.48,57.09) 26.48,57.06 26.42,57.01 ; NOREF#4.10 12.62,56.09 v2(13.46,55.24) 14.86,53.85 U6.17 ; 17.82,47.53 16.94,47.53 16.62,47.85 U6.35 ; 17.82,47.53 19.08,47.53 19.3,47.31 19.3,45.28 ; 17.82,47.53 U6.1 ; 36.79,41.95 C22.1
  Top Layer w0.3: NOREF#26.10 2.67,23.19 4.14,21.72 v2(4.32,21.72) ; NOREF#23.9 2.85,46.05 4.06,44.83 v2(4.32,44.83)
  Top Layer w0.5: v1(12.22,46.04) 11.88,46.04 9.52,43.69 9.52,24 10.55,22.98 R42.1 ; 36.58,41.57 U7.2 v2(36.58,35.94) ; 19.3,43.96 19.3,42.55 19.49,42.36 24.19,42.36 26.41,44.59 C26.2 26.41,47.85 25.26,47.85 24.8,48.3 24.8,52.01 U8.2 ; C20.1 10.52,18.16 10.55,18.2 R42.1 ; v1(19.28,45.28) 19.28,44.02 NOREF#18.10 ; R29.1 36.79,41.95 ; 36.96,41.78 v2(36.96,46.93) ; R42.1 v1(11.3,21.59) 14.61,21.59 R40.1 16.02,18.81 R44.1
  Top Layer w0.8: U8.2 26.47,57.06
  Bottom Layer w0.15: 11.16,21.73 v1(11.3,21.59) ; v2(26.42,46.93) 26.42,46.99 26.41,46.99 ; J7.1 61.54,8.95 61.09,9.4 50.04,9.4 48.13,11.3 48.13,13.46 45.85,15.75 39.88,15.75 38.23,17.4 38.23,28.45 ; v2(4.32,21.72) 4.33,21.73
  Bottom Layer w0.25: 6.17,44.83 J5-1.4
  Bottom Layer w0.3: 4.33,21.73 J10-1.11 11.16,21.73 ; v2(4.32,44.83) 6.17,44.83 ; J5-1.4 8.88,44.82 ; v1(11.3,21.59) 10.94,21.23 J10-1.10 ; J10-1.4 v2(9.71,18.23)
  Bottom Layer w0.5: 38.23,28.45 36.58,30.1 v2(36.58,35.94) T1.1 ; v2(26.42,46.93) v2(36.96,46.93) ; v3(26.48,57.09) 15.13,57.09 14.08,56.04 13.61,56.04 ; 13.04,56.04 13.61,56.04 ; 13.04,56.04 C29.1 ; 13.04,56.04 C27.2 ; 13.61,56.04 13.46,55.9 v2(13.46,55.24)
  Bottom Layer w0.6: 8.88,45.04 9.1,45.04 C19.1 9.57,45.51 C18.2 ; 11.26,45.42 11.88,46.04 v1(12.22,46.04) 18.52,46.04 v1(19.28,45.28)
VDD_3.0V_B: length 89.1
  Top Layer w0.15: BM1.2 54.09,36.65
  Top Layer w0.25: 54.09,35.56 BM1.2
  Top Layer w0.6: v1(54.1,35.56) 54.1,34.35 52.32,32.57 v1(52.32,7.75) ; U9.5 54.48,43.44 53.27,42.23 v1(53.27,38.99) BM1.4
  Bottom Layer w0.25: 18.86,5.02 19.05,5.21 ; 52.29,7.78 v1(52.32,7.75)
  Bottom Layer w0.5: 53.27,36.39 v1(53.27,38.99)
  Bottom Layer w0.6: 53.27,36.39 v1(54.1,35.56) ; 52.29,7.78 21.37,7.78 18.94,5.35 10.94,5.35 10.32,4.73 J4-1.1 ; J2-1.1 18.86,5.02
VDD_3.3V: length 73.3
  Top Layer w0.2: 50.8,55.75 C30.1 ; 50.8,55.75 50.3,56.25 ; 50.8,55.75 52.45,55.75 52.83,55.37 56.98,55.37 57.24,55.12
  Top Layer w0.25: U10.7 50.8,55.75 ; U10.8 50.3,56.25
  Top Layer w0.5: 57.24,51.63 57.24,55.12 ; v2(48.13,48.13) R37.2
  Top Layer w0.6: U9.1 54.48,51.33 C37.1
  Top Layer w1: 59.91,51.63 C14.1 66.08,51.63 67.21,50.5 C13.1 68.74,48.15 R15.2 ; 59.91,51.63 59.27,51.63 ; 59.91,51.63 59.97,51.57 L5.1 ; U8.3 26.33,50.54 C31.1 ; 59.27,51.63 56.83,51.63 ; 59.27,51.63 C15.1 ; v3(56.13,47.97) 56.13,51.14
  Bottom Layer w1: v3(56.13,47.97) 56.01,48.09 29.78,48.09 v3(26.84,51.03)
VDD_5.0V: length 119
  Top Layer w1: D4.1 71.23,33.65 71.23,31.93 C8.1 71.51,31.88 R7.2 71.44,37.46 v3(70.36,37.46) 68.01,37.46 L2.2
  Bottom Layer w1: 2.54,55.65 4.93,55.65 R25.1 6.73,57.44 6.73,61.85 8.39,63.51 70.64,63.51 74.3,59.86 74.3,41.4 v3(70.36,37.46)
VDD_LED_5.0V: length 22.6
  Top Layer w1: T9.1 63.42,30.94 D5.2 63.88,32 68.32,32 69.85,30.47 69.85,29.16 R33.1 ; 63.34,37.08 63.34,43.4
VSS: length 56.9
  Top Layer w0.5: v2(67.44,22.33) 68.42,22.33 68.45,22.36
  Top Layer w0.8: 58.55,15.58 v3(58.55,18.14) 62.85,18.14 63.5,18.78 ; 58.55,15.58 58.57,15.61 C11.2 ; 58.55,15.58 58.55,14.12 58.02,13.59 53.86,13.59
  Bottom Layer w0.5: R20.2 55.48,11.68 55.75,11.41 59.69,11.41 R16.2 ; 66.1,23.34 67.11,22.33 v2(67.44,22.33) ; 66.1,23.34 F1.2 66,23.95 C43.2 ; 66.1,23.34 66.1,23.02 64.01,20.93 C12.2 ; Q2.2 61.21,21.94 C9.2 59.7,18.51 U3.8
  Bottom Layer w0.8: C12.2 63.5,19.53 63.5,15.47 60.71,12.68 R16.2 ; R24.1 55.07,18.14 U3.8
  vias: v2(58.86,12.71) v2(62.71,14.51) v3(63.34,18.78)
CHG_DET: length 45.2
  Top Layer w0.2: v2(51.31,14.22) 51.31,14.73 48.67,17.37 36.86,17.37 36.58,17.65 U7.39 v2(36.58,20.83)
  Bottom Layer w0.2: R14.2 69.85,13.45 70.38,12.92 70.38,11.03 70.01,10.67 54.8,10.67 51.31,14.16 v2(51.31,14.22)
  Bottom Layer w0.5: R14.2 69.03,14.79 R12.2
CM_I2C_CLK: length 31.5
  Top Layer w0.2: v2(13.21,18.8) v2(14.86,18.8) 14.86,17.4 15.26,17 16,17 ; 20.04,29.02 U7.20 ; 4.44,18.67 2.93,20.19 NOREF#5.10
  Bottom Layer w0.2: v2(4.45,18.72) 4.45,18.73 J10-1.5 13.14,18.73 v2(13.21,18.8) ; v2(19.3,28.96) 15.37,28.96 14.48,28.07 14.48,18.67
CM_I2C_DATA: length 31.9
  Top Layer w0.2: NOREF#7.9 2.9,18.69 3.81,17.78 v2(4.44,17.78) ; U7.19 20.07,30.23 v2(18.54,30.23) ; v2(12.46,17.73) R43.1
  Bottom Layer w0.2: T41.1 14.73,30.23 13.97,29.46 13.97,18.36 13.33,17.72 v2(12.46,17.72) 6.31,17.72 J10-1.3 4.37,17.73 4.42,17.78 v2(4.44,17.78)
CM_MCLK: length 22.8
  Top Layer w0.25: v2(18.54,27.69) 20.07,27.69 U7.21 ; NOREF#15.10 2.33,24.69 4.29,22.73 v2(4.44,22.73) ; v2(12.19,22.73) 14.28,22.73 v2(15.24,23.69)
  Bottom Layer w0.25: v2(12.19,22.73) J10-1.13 v2(4.44,22.73) ; T43.1 15.54,27.73 14.9,27.09 14.9,24.02 v2(15.24,23.69)
CM_PWDN: length 47
  Top Layer w0.2: v2(4.32,20.19) 2.83,21.69 NOREF#20.9 ; v2(8.76,20.19) v2(8.76,36.7) ; U7.12 v2(23.88,40.89)
  Bottom Layer w0.2: v2(23.88,40.89) 10,40.89 8.76,39.66 v2(8.76,36.7) ; v2(4.32,20.19) 4.35,20.23 J10-1.8 8.73,20.23 v2(8.76,20.19) 8.8,20.23
CM_SPI_CLK: length 24.2
  Top Layer w0.25: NOREF.9 3.02,26.19 v2(4.48,24.73)
  Bottom Layer w0.25: v2(19.18,31.5) T40.1 14.35,31.5 13.46,30.61 13.46,25.4 12.79,24.73 J10-1.17 v2(4.48,24.73)
CM_SPI_MOSI: length 23.8
  Top Layer w0.2: v2(4.57,26.29) 3.17,27.69 NOREF#17.8 ; v2(18.54,32.77) 20.07,32.77 U7.17
  Bottom Layer w0.2: v2(4.57,26.29) 4.63,26.23 J10-1.20 12.26,26.23 12.7,26.67 12.7,31.88 13.59,32.77 T39.1
CT_MT_CTR: length 11.6
  Top Layer w0.2: R39.1 24.61,11.11 Q6.1 U7.31 v2(26.42,20.83)
D_GND: length 594.2
  Top Layer w0.15: U6.28 13.09,49.24 12.45,48.59 v2(12.45,47.12) 13.97,47.12 14.79,47.94 U6.29 ; U6.11 16.97,54.69 ; 16.97,54.69 v2(17.27,54.99) 19.01,54.99 20.1,56.07 20.1,57.36 ; 16.97,54.69 16.71,54.43 U6.11 16.71,51.7 15.74,50.74 ; NOREF#45.10 1.4,13.46 v2(1.65,13.21) ; C20.2 10.19,15.96 C21.2 v2(10.59,15.62) ; v2(0.76,57.66) 9.98,57.66 11.26,58.93 v2(13.17,58.93) 13.17,62.42 13.59,62.84
  Top Layer w0.25: 28.86,53.65 28.83,53.69 U8.1 ; 28.86,53.65 28.86,47.5 28.55,47.19 28.55,46.4 C26.1 ; 28.86,53.65 28.86,57.38 v2(28.32,57.91) ; BM1.5 v2(51.96,37.24) 51.09,37.24 50.87,37.46 50.87,43.31 ; R39.2 24.61,9.21 Q6.2 ; 37.85,28.19 U7.1 37.85,39.75 C23.2 39.16,41.06 C22.2 39.16,48.18 38.95,48.39 ; 37.85,28.19 U7.40 ; 37.85,28.19 37.77,28.27 U7.41 ; R36.2 48.09,51.43 46.99,52.53 U10.3 46.99,55.25 U10.0 ; C33.2 52.18,53.17 C30.2 ; C33.2 52.83,51.03 53.53,50.33 U9.2 53.53,45.35 C34.1 ; C33.2 52.92,53.09 53.88,54.05 v2(55.24,54.05) ; BM1.5 v2(55.34,39.24) 55.34,39.95 C36.2 ; 50.87,43.31 48.64,43.31 48.13,43.81 48.13,46.99 47.87,47.25 43.93,47.25 42.8,48.39 38.95,48.39 ; 50.87,43.31 52.2,43.31 52.95,44.06 C34.1 ; v2(28.32,57.91) 28.45,57.91 29.84,59.31 29.84,62.84 ; v2(28.32,57.91) 20.41,57.91 19.96,57.64 19.94,57.63 ; NOREF#24.10 2.36,47.55 v2(3.68,46.23) ; BM1.5 55.35,34.91 C35.2 56.86,34.89 57.24,35.26 v2(57.24,37.25) BM1.5 ; C34.1 v2(51.82,44.77) ; U11.3 44.7,11.24 45.4,10.54 47.88,10.54 49.4,9.02 49.4,5.31 J7.6 ; 29.84,62.84 S1.2 S1.2 S2.2 S2.2 ; 29.84,62.84 37.23,62.84 37.72,62.36 J1-1.3 ; C24.1 34.04,45.47 36.96,48.39 38.95,48.39 ; C8.2 73.59,33.84 v2(74.68,34.92) ; 41.27,13.04 v2(41.27,14.22) ; v2(50.8,57.4) 58.55,57.4 59.44,56.51 59.44,54.04 59.44,54.05 v2(60.52,54.05) ; U10.0 46.49,55.75 U10.11 46.49,57.91 45.85,58.55 v2(44.58,58.55) 41.01,58.55 36.82,54.36 32.76,54.36 32.39,53.98 R30.2 ; U10.0 46.49,55.25 U10.15 ; C39.2 v2(33.53,14.1) ; v2(72.45,50.74) 72.45,48.64 C4.2
  Top Layer w0.3: C3.2 74.29,48.19 C5.1 ; U2.3 71.08,40.93 v2(70.99,40.84)
  Top Layer w0.5: C30.2 51.05,54.29 v2(50.09,54.29) ; v2(68.99,43.03) 68.99,44.62 R18.1
  Top Layer w0.8: J4-1.3 14.32,1.55 14.92,0.95 22.35,0.95 22.86,1.47 J2-1.3 22.86,8.68 v2(23.44,9.26) R39.2 26.52,9.26
  Top Layer w1: C15.2 59.29,53.83 C14.2 ; C16.1 60.6,39.54 v2(60.6,38.67)
  Bottom Layer w0.15: 1.4,44.45 1.4,49.78 0.76,50.42 v2(0.76,57.66) ; 1.4,44.45 2.27,45.32 3.68,45.32 ; 1.4,44.45 1.4,24.18 1.65,23.92 ; 1.65,17.27 1.69,17.23 J10-1.2 7.92,17.23 9.52,15.62 v2(10.59,15.62) ; 8.89,57.91 8.96,57.84 C27.1 12.79,58.93 v2(13.17,58.93) 13.06,58.83 C29.2 ; v2(12.45,47.12) 12.45,49.28 ; v2(17.27,54.99) 17.39,54.88
  Bottom Layer w0.2: 3.68,45.32 J5-1.3
  Bottom Layer w0.25: R21.2 51.79,16.74 R11.1 49.78,19.11 R24.2 50.19,35.47 v2(51.96,37.24) ; v2(28.32,57.91) 28.32,56.65 30.62,54.36 v2(36.83,54.36) C1.1 ; v2(72.45,50.74) 72.45,50.09 70.8,48.45 68.96,50.29 65.02,50.29 63.5,48.77 62.15,50.11 U5.1 ; 66.55,39.24 68.96,39.24 70.8,41.08 ; 66.55,39.24 66.55,35.81 67.44,34.92 v2(74.68,34.92) ; 66.55,39.24 57.28,39.24 ; U5.3 v2(60.52,54.05) v2(55.24,54.05) ; 11.01,47.71 11.81,48.51 11.81,49.28 14.22,49.28 ; 11.01,47.71 C18.1 ; 11.01,47.71 9.99,47.71 7.6,45.32 J5-1.3 ; v2(50.8,57.4) 45.72,57.4 v2(44.58,58.55) ; 57.28,39.24 57.24,39.2 v2(57.24,37.25) ; 57.28,39.24 v2(55.34,39.24) ; v2(10.59,15.62) 13.59,15.62 17.14,12.06 31.5,12.06 v2(33.53,14.1) v1(36.7,14.1) 36.83,14.22 v2(41.27,14.22) v1(44.7,14.22) ; Q1.2 18.03,55.75 v2(17.27,54.99) ; 3.68,45.32 v2(3.68,46.23) ; 70.8,43.56 67.31,43.56 67.14,43.73 61.26,43.73 59.71,45.28 52.33,45.28 v2(51.82,44.77) ; Q5.2 1.77,9.02 C38.2 v2(1.65,13.21) 1.65,23.92 ; 1.4,25.02 2.03,25.02 3.32,23.73 J10-1.15
  Bottom Layer w0.5: v2(12.28,14.2) 12.28,15.62
  Bottom Layer w0.8: 23.4,12.06 23.44,12.02 v2(23.44,9.26)
  Bottom Layer w1: 70.8,42.68 70.8,43.56 72.55,45.31 72.45,45.41 72.45,50.09 ; 70.8,42.68 70.8,41.08 ; 70.8,42.68 40.76,42.68 v2(40.38,42.3)
  vias: v2(1.45,57.02) v2(1.56,33.8) v2(1.65,11.96) v2(1.67,10.23) v2(2.94,33.81) v2(3.66,57.73) v2(4.69,33.85) v2(9.53,14.2) v2(11.64,61.21) v2(14.65,61.23) v2(15.38,14.2) v2(23.33,61.56) v2(24.38,31.45) v2(26.19,28.8) v2(26.32,31.55) v2(26.35,26.17) v2(26.44,61.5) v2(27.76,25.09) v2(28.55,61.46) v2(30.16,31.29) v2(31.04,24.86) v2(32.95,31.52) v2(33.51,30.01) v2(34.46,25.12) v2(34.85,26.86) v2(41.31,42.32) v2(42.19,42.28) v2(43.42,42.27) v2(55.35,35.53) v2(57.63,42.72) v2(59.61,42.79) v2(59.77,40.56) v2(61.3,35.04) v2(63.19,49.03) v2(64.38,49) v2(64.47,47.72) v2(65.52,49) v2(66.75,43.04) v2(67.93,43.04) v2(70.85,50.79) v2(70.98,40.21) v2(74.8,34.16) v2(75.45,34.71)
DEVICE: length 3.6
  Top Layer w0.15: U6.34 16.32,47.41 17.58,46.15 NOREF#38.10
EN: length 48.3
  Top Layer w0.25: 34.81,40.12 35.31,39.62 U7.3 v2(35.31,35.81) ; C24.2 34.68,40.15 R29.2
  Bottom Layer w0.25: 35.31,34.8 T2.1 35.31,30.13 37.88,27.56 37.88,16.72 39.38,15.22 45.74,15.22 47.78,13.18 47.78,11.02 49.91,8.89 55.12,8.89 55.63,8.38 55.63,7.87
EXD_LED_EN: length 67.2
  Top Layer w0.15: v2(4.44,7.11) 6.48,9.14 v2(6.48,52.32) ; U6.8 18.94,51.37 v2(20.02,52.45) 21.01,53.44 NOREF#9.10
  Bottom Layer w0.15: 3.43,7.11 v2(4.44,7.11) 5.19,7.11 Q5.1 ; v2(6.48,52.32) 6.61,52.45 v2(20.02,52.45)
EXP_BST_EN: length 52.4
  Top Layer w0.15: 22.74,47.43 21.65,47.49 18.97,50.17 U6.4
  Top Layer w0.3: U4.1 v2(66.12,46.69)
  Bottom Layer w0.15: v2(66.12,46.69) 65.2,45.78 23.19,45.78 v2(21.55,47.42)
EXP_DOOR_DET: length 7.3
  Top Layer w0.15: S2.1 17.06,59.34 17.06,56.38 16.06,55.39 U6.13
EXP_KET_DET: length 8.8
  Top Layer w0.15: S1.1 18.59,58.53 18.59,55.89 18.39,55.68 17.07,55.68 16.41,55.03 U6.12
EXP_LCDLED_EN: length 13.6
  Top Layer w0.15: 22.75,50.51 20.48,50.51 v2(20.22,50.77) 20.22,50.77 U6.6
  Bottom Layer w0.15: 11.81,51.18 19.81,51.18 v2(20.22,50.77)
EXP_MIC_EN: length 43.7
  Top Layer w0.15: v2(50.29,43.96) 50.29,48.6 50.7,49.02 U9.3 ; U6.2 18.39,49.57 20.04,47.92 20.04,45.98 20.92,45.1 NOREF#27.10 22.21,43.95 v2(22.22,43.96)
  Bottom Layer w0.15: v2(22.22,43.96) v2(50.29,43.96)
EXP_PRT_EN: length 12.2
  Top Layer w0.15: U6.5 19.5,50.47 21.03,48.94 NOREF#22.10
  Bottom Layer w0.15: R4.1 23.2,53.84 Q1.1 23.22,53.83 v2(23.22,48.94)
EXP_SPI_CLK: length 30.8
  Top Layer w0.15: 15.29,41.2 14.72,41.77 T55.1 14.72,45.57 15.39,46.25 U6.31
  Top Layer w0.25: v2(18.67,22.62) U7.25 ; v2(15.29,38.35) 15.29,41.2
  Bottom Layer w0.25: v2(18.67,22.62) 19.83,23.78 19.83,29.17 19.81,29.19 19.81,35.18 16.64,38.35 v2(15.29,38.35)
EXP_SPI_CS: length 34.1
  Top Layer w0.15: 16.64,23.89 20.08,23.89 U7.24 20.1,23.88 v2(21.59,23.88) ; 16.02,48.37 16.02,47.1 17.72,45.4 T58.1 17.72,40.07 v2(18.41,39.37)
  Top Layer w0.25: 16.64,23.89 15.62,22.87 15.62,21.98
  Bottom Layer w0.15: v2(18.41,39.37) 20.83,36.96 20.83,24.64 v2(21.59,23.88)
EXP_SPI_MISO: length 19.1
  Top Layer w0.15: 19.85,34.05 17.1,34.05 16.23,34.92 16.23,45.46 15.72,45.97 U6.32
  Top Layer w0.25: 19.85,34.05 U7.16
  Bottom Layer w0.15: 17.14,44.18 17.01,44.18 v2(16.25,44.94)
EXP_SPI_MOSI: length 35.2
  Top Layer w0.15: U6.30 15.09,47.73 13.21,45.85 13.21,43.94
  Top Layer w0.25: v2(13.21,40) 13.21,43.94
  Bottom Layer w0.25: v2(19.18,21.34) 20.32,22.48 20.32,35.56 15.88,40 v2(13.21,40) T36.1
EXP_SPK_EN: length 44.2
  Top Layer w0.15: U6.3 18.6,49.87 20.49,47.98 20.49,46.33 20.92,45.9 21.65,45.9 ; v2(49.4,45.07) 49.4,51.75 49.4,51.76 47.49,53.68 U10.4
  Bottom Layer w0.15: v2(49.4,45.07) 22.49,45.07 v2(21.65,45.91)
EXP_VUSB_DET: length 71.9
  Top Layer w0.15: NOREF#11.10 v2(21.54,51.94) 20.4,51.94 19.53,51.07 U6.7 ; v2(46.74,18.03) v2(46.74,46.35)
  Bottom Layer w0.15: v2(46.74,46.35) 46.69,46.31 24.71,46.31 21.54,49.48 v2(21.54,51.94) ; v2(46.74,18.03) 46.74,15.98 47.77,14.94 49.78,14.94
  Bottom Layer w0.5: 48.78,14.94 48.78,12.31 49.02,12.06 49.77,12.06
FE_MT_BK: length 17.8
  Top Layer w0.15: U12.2 37.97,14.21 37.45,14.73 28.7,14.73 27.69,15.75 v2(27.69,18.14) U7.32
  Bottom Layer w0.15: T24.1 v2(27.69,18.14)
FE_MT_FW: length 17.8
  Top Layer w0.2: v2(28.96,20.83) U7.33 28.96,15.49 29.34,15.11 38.99,15.11 39.24,14.86 U12.1
FL_MT_BK: length 23.4
  Top Layer w0.15: U7.34 v2(30.23,18.16) 30.23,16 30.73,15.49 45.34,15.49 45.97,14.86 U11.2
  Bottom Layer w0.15: T20.1 v2(30.23,18.16)
FL_MT_FW: length 22.4
  Top Layer w0.2: U11.1 47.24,14.6 46.03,15.82 32.17,15.82 31.5,16.49 U7.35 v2(31.5,20.83)
FLAG_VR_DET: length 20.1
  Top Layer w0.2: 20.67,3.3 20.67,9.68 23.88,12.89 v2(23.88,18.54) U7.29
  Bottom Layer w0.2: v2(23.88,18.54) 23.11,17.78 T30.1
IR_FIN_DET: length 24.8
  Top Layer w0.2: U7.28 v2(22.61,18.54) 22.61,12.19 15.49,5.08 12.83,5.08 12.32,4.57 J4-1.2
  Bottom Layer w0.2: v2(22.61,18.54) 21.08,17.02 T32.1
L_GND: length 5.6
  Bottom Layer w0.8: Q5.3 7.47,4.07 J8.4
LCD_A0: length 33.9
  Top Layer w0.25: v2(2.92,42.29) 2.18,41.55 NOREF#47.9 ; U7.8 v2(28.96,42.42)
  Bottom Layer w0.25: v2(28.96,42.42) 28.05,43.32 J5-1.7 3.95,43.32 v2(2.92,42.29)
LCD_CS: length 40.7
  Top Layer w0.25: v2(2.79,43.05) 1.53,43.05 NOREF#10.10 ; U7.23 v2(18.67,25.16) 11.49,25.16 10.8,25.85 v2(10.8,43.81)
  Bottom Layer w0.25: v2(2.79,43.05) 3.56,43.82 J5-1.6 10.79,43.82 v2(10.8,43.81) 13.68,43.81 R41.2
LCD_RST: length 39.1
  Top Layer w0.25: 19.05,26.42 20.08,26.42 20.09,26.42 ; v2(3.33,44.58) 3.3,44.55 NOREF#44.10 ; v2(11.68,44.45) 11.68,27.05 12.31,26.43 U7.22 21.7,26.43 v2(21.72,26.42)
  Bottom Layer w0.25: v2(3.33,44.58) 3.58,44.32 J5-1.5 11.55,44.32 v2(11.68,44.45)
LCD_SPI_CLK: length 30
  Top Layer w0.25: v2(22.61,41.54) 22.61,37.09 U7.13 v2(22.61,35.9) ; NOREF#29.9 3.37,38.55 4.7,39.88 v2(4.7,41.78)
  Bottom Layer w0.25: v2(4.7,41.78) 5.23,42.32 J5-1.9 22.32,42.32 22.61,42.03 v2(22.61,41.54)
LCD_SPI_MOSI: length 27.5
  Top Layer w0.25: U7.14 T33.1 v2(21.34,41.53) ; NOREF#21.10 3.39,37.05 v2(4.7,38.35)
  Bottom Layer w0.25: v2(4.7,38.35) 6.18,39.83 J5-1.10 21.05,41.82 v2(21.34,41.53)
LCD_TE: length 33.1
  Top Layer w0.25: v2(3.56,41.78) 3.56,40.77 2.83,40.05 NOREF#32.10 ; U7.9 v2(27.69,41.91)
  Bottom Layer w0.25: v2(3.56,41.78) 4.59,42.82 J5-1.8 24.08,42.82 24.99,41.91 T23.1 v2(27.69,41.91)
LED_CLK: length 77.2
  Top Layer w0.25: 21.34,17.78 21.34,12.7 v2(17.02,8.38) 14.73,6.1 3.68,6.1 3.33,5.74 J8.2 ; 21.34,17.78 21.28,17.73 v2(19.05,17.73) ; 21.34,17.78 U7.27
  Bottom Layer w0.25: T34.1 v2(19.05,17.73) ; v2(17.02,8.38) 52.97,8.38 R31.1 54.37,6.98 R32.2
LED_DATA: length 31.3
  Top Layer w0.2: v2(25.15,17.4) U7.30 ; J8.3 4.83,4.95 5.46,5.59 15.11,5.59 21.97,12.45 v2(21.97,14.1)
  Bottom Layer w0.3: v2(21.97,14.1) 24.66,14.1 25.15,14.58 T28.1
MIC CLK: length 41.5
  Top Layer w0.2: U7.15 19.43,35.97 v2(19.43,40.13) ; v2(54.1,38.99) 54.09,38.98 BM1.3
  Bottom Layer w0.2: v2(54.1,38.99) 54.1,39.68 53.65,40.13 v2(19.43,40.13)
MIC_DATA: length 36.9
  Top Layer w0.25: v2(48.01,20.45) 48.01,29.46 53.27,34.73 BM1.1 ; U7.38 35.31,17.91 36.22,16.99 47.65,16.99 v2(48.01,16.64)
  Bottom Layer w0.25: v2(48.01,16.64) v2(48.01,20.45)
  vias: v2(35.43,17.65)
NETC2_2: length 9.6
  Top Layer w0.3: C2.2 73.31,35.61 R7.1 73.39,37.31 R6.2 74.92,41.25 74.24,41.93 U2.6
NETC6_1: length 9.2
  Top Layer w0.3: L2.1 67.88,39.42 68.23,39.07 C6.1 ; 70.5,41.43 U2.2
  Top Layer w0.5: 70.5,41.43 68.45,41.43 67.88,40.86 L2.1
NETC6_2: length 2.5
  Top Layer w0.3: U2.4 73.38,40.93 73.55,40.76 73.55,39.32 C6.2
NETC9_1: length 41
  Top Layer w0.025: 56.26,19.05 56.51,19.05 56.26,19.05
  Top Layer w0.5: 56.26,19.05 56.26,15.85 v2(55.63,15.22) ; 56.26,19.05 56.2,18.99 53.86,18.99 ; 56.26,19.05 56.26,23.22
  Bottom Layer w0.5: C9.1 57.9,23.12 D2.2
  Bottom Layer w0.8: v2(55.63,15.22) 55.48,15.07 R17.1
  Bottom Layer w1: 55.42,23.26 54.59,24.08 54.59,30.84 55.88,32.13 D1.1 ; 55.42,23.26 D2.2 ; 55.42,23.26 v3(55.43,23.24)
NETC11_1: length 11.6
  Top Layer w0.8: v2(65.91,13.18) 65.91,15.7 66.04,15.83 66.78,15.83 67.31,16.36 v3(67.31,18.14)
  Bottom Layer w0.5: NTC1.2 v2(65.91,13.18) ; U3.1 65.81,18.29 C12.1
  Bottom Layer w0.8: D3.2 68.57,18.14 U3.1
NETC13_2: length 5.3
  Top Layer w0.2: U4.6 66.64,44.09 R18.2 67.21,44.66 C13.2 68.74,46.35 R15.1
NETC17_2: length 6.5
  Bottom Layer w0.5: U3.7 53.98,16.87 R21.1
NETC28_2: length 2.9
  Bottom Layer w0.25: C28.2 55.5,3.21 J7.4
NETC42_1: length 11.1
  Top Layer w0.6: U11.8 47.24,4.44 J12-1.2 45.97,4.19 U11.7
  Bottom Layer w0.6: J12-1.2 46.48,6.06 C42.1
NETC42_2: length 11.1
  Top Layer w0.6: U11.6 44.7,4.44 J12-1.1 43.43,4.19 U11.5
  Bottom Layer w0.6: C42.2 43.94,6.09 J12-1.1
NETC44_1: length 10.4
  Top Layer w0.6: U12.8 39.24,4.76 38.39,3.9 37.97,4.32 U12.7
  Bottom Layer w0.6: C44.1 38.61,6.09 J14-1.2
NETC44_2: length 10.8
  Top Layer w0.6: U12.5 35.43,4.32 J14-1.1 36.7,4.32 36.7,7.37
  Bottom Layer w0.6: J14-1.1 36.07,6.07 C44.2
NETD2_1: length 4.6
  Bottom Layer w0.5: D2.1 58.23,28.07
  Bottom Layer w1: Q2.3 61.14,28.07 v3(60.71,28.07) 58.23,28.07
NETF1_1: length 21.4
  Top Layer w0.8: USB1.1 75.78,17.21 76.2,17.63 76.2,22.2 75.69,22.71 USB1.6
  Bottom Layer w0.5: R10.2 68.95,23.21 F1.1
  Bottom Layer w0.8: F1.1 71.75,23.85 72.9,22.71 USB1.6 74.55,23.78 USB1.0 ; USB1.0 74.55,16.14 USB1.1
NETJ3-1_3: length 12.4
  Bottom Layer w0.3: U5.7 64.45,53.4 U5.7 ; J3-1.3 64.03,59.46 U5.7 ; U5.6 64.45,54.05 U5.5 64.27,54.7 65.35,54.7 ; U5.7 64.27,52.75 U5.8
NETJ5-1_1: length 12.9
  Bottom Layer w0.25: 4.93,53.45 R25.2 ; J5-1.1 6.27,46.32
  Bottom Layer w0.5: 4.93,53.45 R26.2 v2(2.54,50.55) ; 6.27,46.53 6.27,50.18 4.95,51.5 R25.2
NETJ5-1_2: length 14.6
  Top Layer w0.2: v2(4.44,46.35) 4.44,48.13 3.53,49.05 NOREF#43.9
  Bottom Layer w0.2: v2(4.44,46.35) 4.98,45.82 J5-1.2 7.34,45.82 8.13,46.61 8.13,50.15 8.47,50.49 Q4.3
NETJ7_5: length 2.9
  Top Layer w0.25: J7.5 53.57,3.21
  Bottom Layer w0.25: R31.2 53.57,3.21 J7.5
NETJ8-1_1: length 3.8
  Top Layer w0.25: J8-1.1 48.49,58.88 47.49,57.88 U10.9
NETJ8-1_2: length 3.4
  Top Layer w0.25: U10.10 46.99,60.45 J8-1.2
NETJ15-1_1: length 6.8
  Top Layer w0.8: J15-1.1 27.94,4.99 28.68,5.73 Q6.3
NETLED13_1: length 9.8
  Top Layer w0.3: v2(67.95,12.83) 68.45,13.33 68.45,20.77
  Bottom Layer w0.3: v2(67.95,12.83) 67.95,12.74 R14.1
NETQ1_3: length 6.8
  Bottom Layer w0.5: U1.4 28.39,51.64 Q1.3
NETQ2_1: length 11.7
  Bottom Layer w0.5: 60.07,15.6 61.8,15.6 62.1,15.9 62.1,20.93 63.12,21.95 Q2.1
NETR2_2: length 6.3
  Bottom Layer w0.5: R2.2 36.4,57.23 U1.8 U1.7 U1.6 U1.5
NETR8_2: length 3
  Top Layer w0.3: U2.5 72.43,41.43 72.28,41.58 72.28,42.92 R8.2
NETR9_1: length 4.2
  Bottom Layer w0.8: USB1.4 72.68,20.51 71.75,21.44 R9.1
NETR10_1: length 4
  Bottom Layer w0.8: R10.1 71.26,19.41 USB1.3
NETR12_1: length 3.4
  Bottom Layer w0.5: 68.94,16.48 68.55,16.87 U3.2
NETR17_2: length 4.3
  Bottom Layer w0.5: U3.5 57.28,14.33 R17.2 R20.1
NETR19_2: length 1.8
  Top Layer w0.2: 64.47,42.64 R19.2
  Top Layer w0.5: 64.47,42.64 U4.5
NETR22_2: length 2.6
  Bottom Layer w0.3: R22.2 60.45,52.7 61.14,53.4 U5.2
NETR23_2: length 2.6
  Bottom Layer w0.3: 62.15,54.7 61.26,54.7 60.71,55.24 R23.2
NETR36_1: length 4.1
  Top Layer w0.25: R37.1 46.49,50.06 U10.2
PA7: length 6.1
  Top Layer w0.15: U6.9 18.42,51.69 21.5,54.77 22.65,54.77
PB0: length 7.5
  Top Layer w0.15: U6.10 18.34,52.04 20.73,54.43 20.73,55.71 21.46,56.44 NOREF#37.10
PB3: length 3.9
  Top Layer w0.15: U6.14 15.76,57.15
PB4: length 4.7
  Top Layer w0.15: 14.09,57.33 14.09,56.08 14.98,55.19 14.98,55.18 15.46,54.7 U6.15
PC0: length 7.9
  Top Layer w0.15: 9.34,56.46 10.7,56.46 12.33,54.83 12.33,52.14 12.79,51.68 U6.20
PC1: length 7
  Top Layer w0.15: 9.27,54.88 9.36,54.88 ; U6.21 12.52,51.38 11.83,52.07 11.83,54.08 10.97,54.94 NOREF#25.10
PC2: length 6.1
  Top Layer w0.15: U6.22 12.2,51.04 11.4,51.84 11.4,52.99 10.95,53.44 NOREF#16.10 9.26,53.44
PC3: length 4.9
  Top Layer w0.15: 9.23,51.94 NOREF#49.10 10.1,51.94 11.3,50.74 U6.23
PC4: length 4.4
  Top Layer w0.15: 9.25,50.44 U6.24
PC5: length 4.9
  Top Layer w0.15: U6.25 12.25,50.14 11,48.89 9.24,48.89
PC6: length 5.3
  Top Layer w0.15: U6.26 12.6,49.84 10.21,47.45 9.31,47.45
PC7: length 6.7
  Top Layer w0.15: U6.27 12.76,49.54 11.79,48.57 11.79,46.91 10.81,45.93 9.43,45.93
PRT_POWER: length 6.5
  Bottom Layer w0.5: J1-1.4 40.39,60.71 C1.2
PRT_PW_DET: length 16.4
  Top Layer w0.25: R3.2 33.91,49.77 R30.1 32.39,46.86 30.23,44.7 U7.7 v2(30.23,35.81)
PRT_RXD: length 29.2
  Top Layer w0.25: U7.10 26.42,41.55 30.61,45.74 30.61,57.15 31.37,57.91 34.54,57.91 35.18,58.55 J1-1.2
  vias: v2(26.41,38.44)
PRT_TXD: length 28
  Top Layer w0.25: v2(25.15,35.9) U7.11 25.15,41.02 30.03,45.91 30.03,58.23 J1-1.1
RXD0: length 37.4
  Top Layer w0.25: J7.3 57.54,5.46 57.15,5.84 51.94,5.84 50.95,6.84 50.95,11.68 46.43,16.19 33.34,16.19 32.77,16.76 v2(32.77,17.53) U7.36
SLED_VDD: length 101.7
  Top Layer w1: v3(69.85,8.38) 69.86,8.39 R33.2 69.87,27.35 69.87,26.34 69.87,27.35
  Bottom Layer w0.5: 1.65,3.1 C38.1
  Bottom Layer w1: J8.1 1.83,1.34 2.41,0.75 68.44,0.75 69.85,2.16 v3(69.85,8.38)
SPK_CLK: length 25.7
  Top Layer w0.25: U7.4 34.04,38.87 32.77,40.14 32.77,44.96 41.12,53.31 v2(42.67,53.31) ; U10.16 42.68,54.75 v2(42.67,54.74)
  Bottom Layer w0.25: v2(42.67,54.74) 42.67,54.73 v2(42.67,53.31)
SPK_DATA: length 26.9
  Top Layer w0.25: U10.1 40.97,53.92 32.26,45.21 32.26,39.7 32.77,39.19 U7.5 v2(32.77,35.81)
SPK_FS: length 26.2
  Top Layer w0.25: U7.6 31.5,45.21 42.03,55.75 U10.14
  vias: v2(31.48,38.43)
T3: length 4.8
  Bottom Layer w0.5: U3.4 64.52,14.33 64.11,13.92 NTC1.1 R16.1
TXD0: length 39.3
  Top Layer w0.25: v2(34.04,20.83) U7.37 34.04,17.02 34.46,16.59 46.88,16.59 51.47,12.01 51.47,7.08 52.2,6.35 58.77,6.35 59.54,5.59 J7.2
VUSB_5.0V: length 60.2
  Top Layer w0.3: 66.67,25.5 66.8,25.38
  Top Layer w0.8: 66.67,25.5 66.67,30.48
  Top Layer w1: v3(67.94,25.38) 66.08,25.38 65.49,24.78
  Bottom Layer w0.3: 71.38,17.12 72.26,16.24 72.26,11.79 70.64,10.16 53.48,10.16 R5.2
  Bottom Layer w0.8: 76.15,21.61 76.58,22.04 76.58,25.12 75.18,26.52 C43.1 67.94,26.26 v3(67.94,25.38) ; 76.15,21.61 76.15,18.59 75.86,18.31 USB1.2 71.55,18.31 D3.1 71.38,17.12 ; 76.15,21.61 USB1.5

## Copper pours and planes (outline as drawn; the poured copper is in the pictures)
VBAT_7.4V on Top Layer: 70.25,46.89 71.61,46.89 71.61,41.93 70.25,41.93
VBAT_7.4V on Top Layer: 60.1,57.99 60.1,61.29 60.51,61.7 68.11,61.7 76.26,53.55 76.26,24.54 77.17,23.63 77.17,16.61 70.8,10.24 70.8,4.1 68.53,1.83 33.58,1.83 32.93,2.48 32.93,7.7 34.35,9.12 43.78,9.12 43.94,9.28 43.94,14.1 43.83,14.21 43.07,14.21 42.94,14.08 42.94,11.76 42.65,11.47 32.92,11.47 29.63,8.18 29.63,0.13 29.87,-0.11 73.69,-0.11 74.51,0.72 74.51,8.2 79.91,13.6 79.91,55.22 70.88,64.25 56.11,64.25 56.11,58.08 56.2,57.99
VBAT_7.4V on Top Layer: 70.25,46.89 77.27,46.89 77.27,45.72 70.25,45.72
VBAT_7.4V on Bottom Layer: 31.64,52.54 31.64,50.05 31.87,49.82 53.17,49.82 54.48,51.13 54.48,56.81 54.87,57.2 59.91,57.2 60.12,57.41 60.12,61.07 59.88,61.31 52.1,61.31 51.45,60.66 51.45,53.86 50.13,52.54
VDD_3.3V on Top Layer: 54.21,49.63 56.15,49.63 56.15,48.81 54.21,48.81
VDD_3.3V on Top Layer: 50.73,56.38 57.48,56.38 57.48,55.14 50.73,55.14
VDD_3.3V on Top Layer: 49.29,56.38 51.51,56.38 51.51,55.65 49.29,55.65
VDD_3.3V on Top Layer: 55.97,55.92 57.48,55.92 57.48,47.46 55.97,47.46
VDD_LED_5.0V on Top Layer: 62.47,44.6 63.77,44.6 63.77,41.65 62.47,41.65
VSS on Top Layer: 57.7,19.56 63.79,19.56 63.79,12.06 57.7,12.06
VSS on Top Layer: 53.48,14.17 60.11,14.17 60.11,12.06 53.48,12.06
VSS on Bottom Layer: 72.83,32.02 56.29,32.02 54.11,29.84 54.11,11.82 54.97,10.96 70.21,10.96 72.3,13.05 72.3,14.57 72.43,14.7 75.89,14.7 77.01,15.82 77.01,27.84
D_GND on Top Layer: -0.18,64.5 -0.18,0.31 79.7,0.31 80.03,0.63 80.03,64.37 79.83,64.57
D_GND on Top Layer: 64.16,48.07 64.77,48.07 64.77,46.17 64.16,46.17
D_GND on Top Layer: 16.64,54.82 17.1,55.28 18.87,55.28 19.63,56.04 19.63,57.59 20.6,57.59 20.61,57.6 20.61,56 18.89,54.28 17.42,54.28 17.05,53.91 17.05,53.75 16.65,53.75 16.64,53.76
D_GND on Bottom Layer: 61.36,52.92 62.65,52.92 62.65,48.44 61.36,48.44
D_GND on Bottom Layer: 62.65,49.65 64.48,49.65 64.48,48.44 62.65,48.44
D_GND on Bottom Layer: 0,64.26 0,0 80.01,0 80.01,64.26
D_GND on Bottom Layer: 62.25,50.83 70.96,50.83 70.96,49.11 62.25,49.11
D_GND on Bottom Layer: 69.16,50.83 71.98,50.83 71.98,45.8 69.16,45.8
NETC6_1 on Top Layer: 66.08,41.69 70.13,41.69 70.13,38.94 66.08,38.94
NETC6_1 on Top Layer: 69.52,41.29 70.33,41.29 70.33,39.08 69.52,39.08
NETC9_1 on Top Layer: 53.6,23.85 56.5,23.85 56.5,17.55 53.6,17.55
NETF1_1 on Bottom Layer: 69.94,25.27 74.96,25.27 74.96,23.69 69.94,23.69
NETF1_1 on Bottom Layer: 73.17,17.49 75.19,17.49 75.19,14.23 73.17,14.23
NETJ3-1_3 on Top Layer: 63.16,60.91 65.32,60.91 65.32,57.75 63.16,57.75
NETJ3-1_3 on Bottom Layer: 63.18,61.3 66.18,61.3 66.18,51.88 63.18,51.88
NETL5_2 on Top Layer: 58.94,47.49 63.84,47.49 63.84,46.14 58.94,46.14
NETR2_2 on Bottom Layer: 30.34,58.44 37.67,58.44 37.67,55.88 30.34,55.88
PRT_POWER on Bottom Layer: 39.42,62.04 41.43,62.04 41.43,53.54 39.42,53.54

Small or netless copper shapes (teardrops, artwork), in the pictures only: 430 on Top Layer, 363 on Bottom Layer

## Text on the board
Top Layer: +
